# Altium project RPI_POE_ADC_SHIELD.PrjPcb
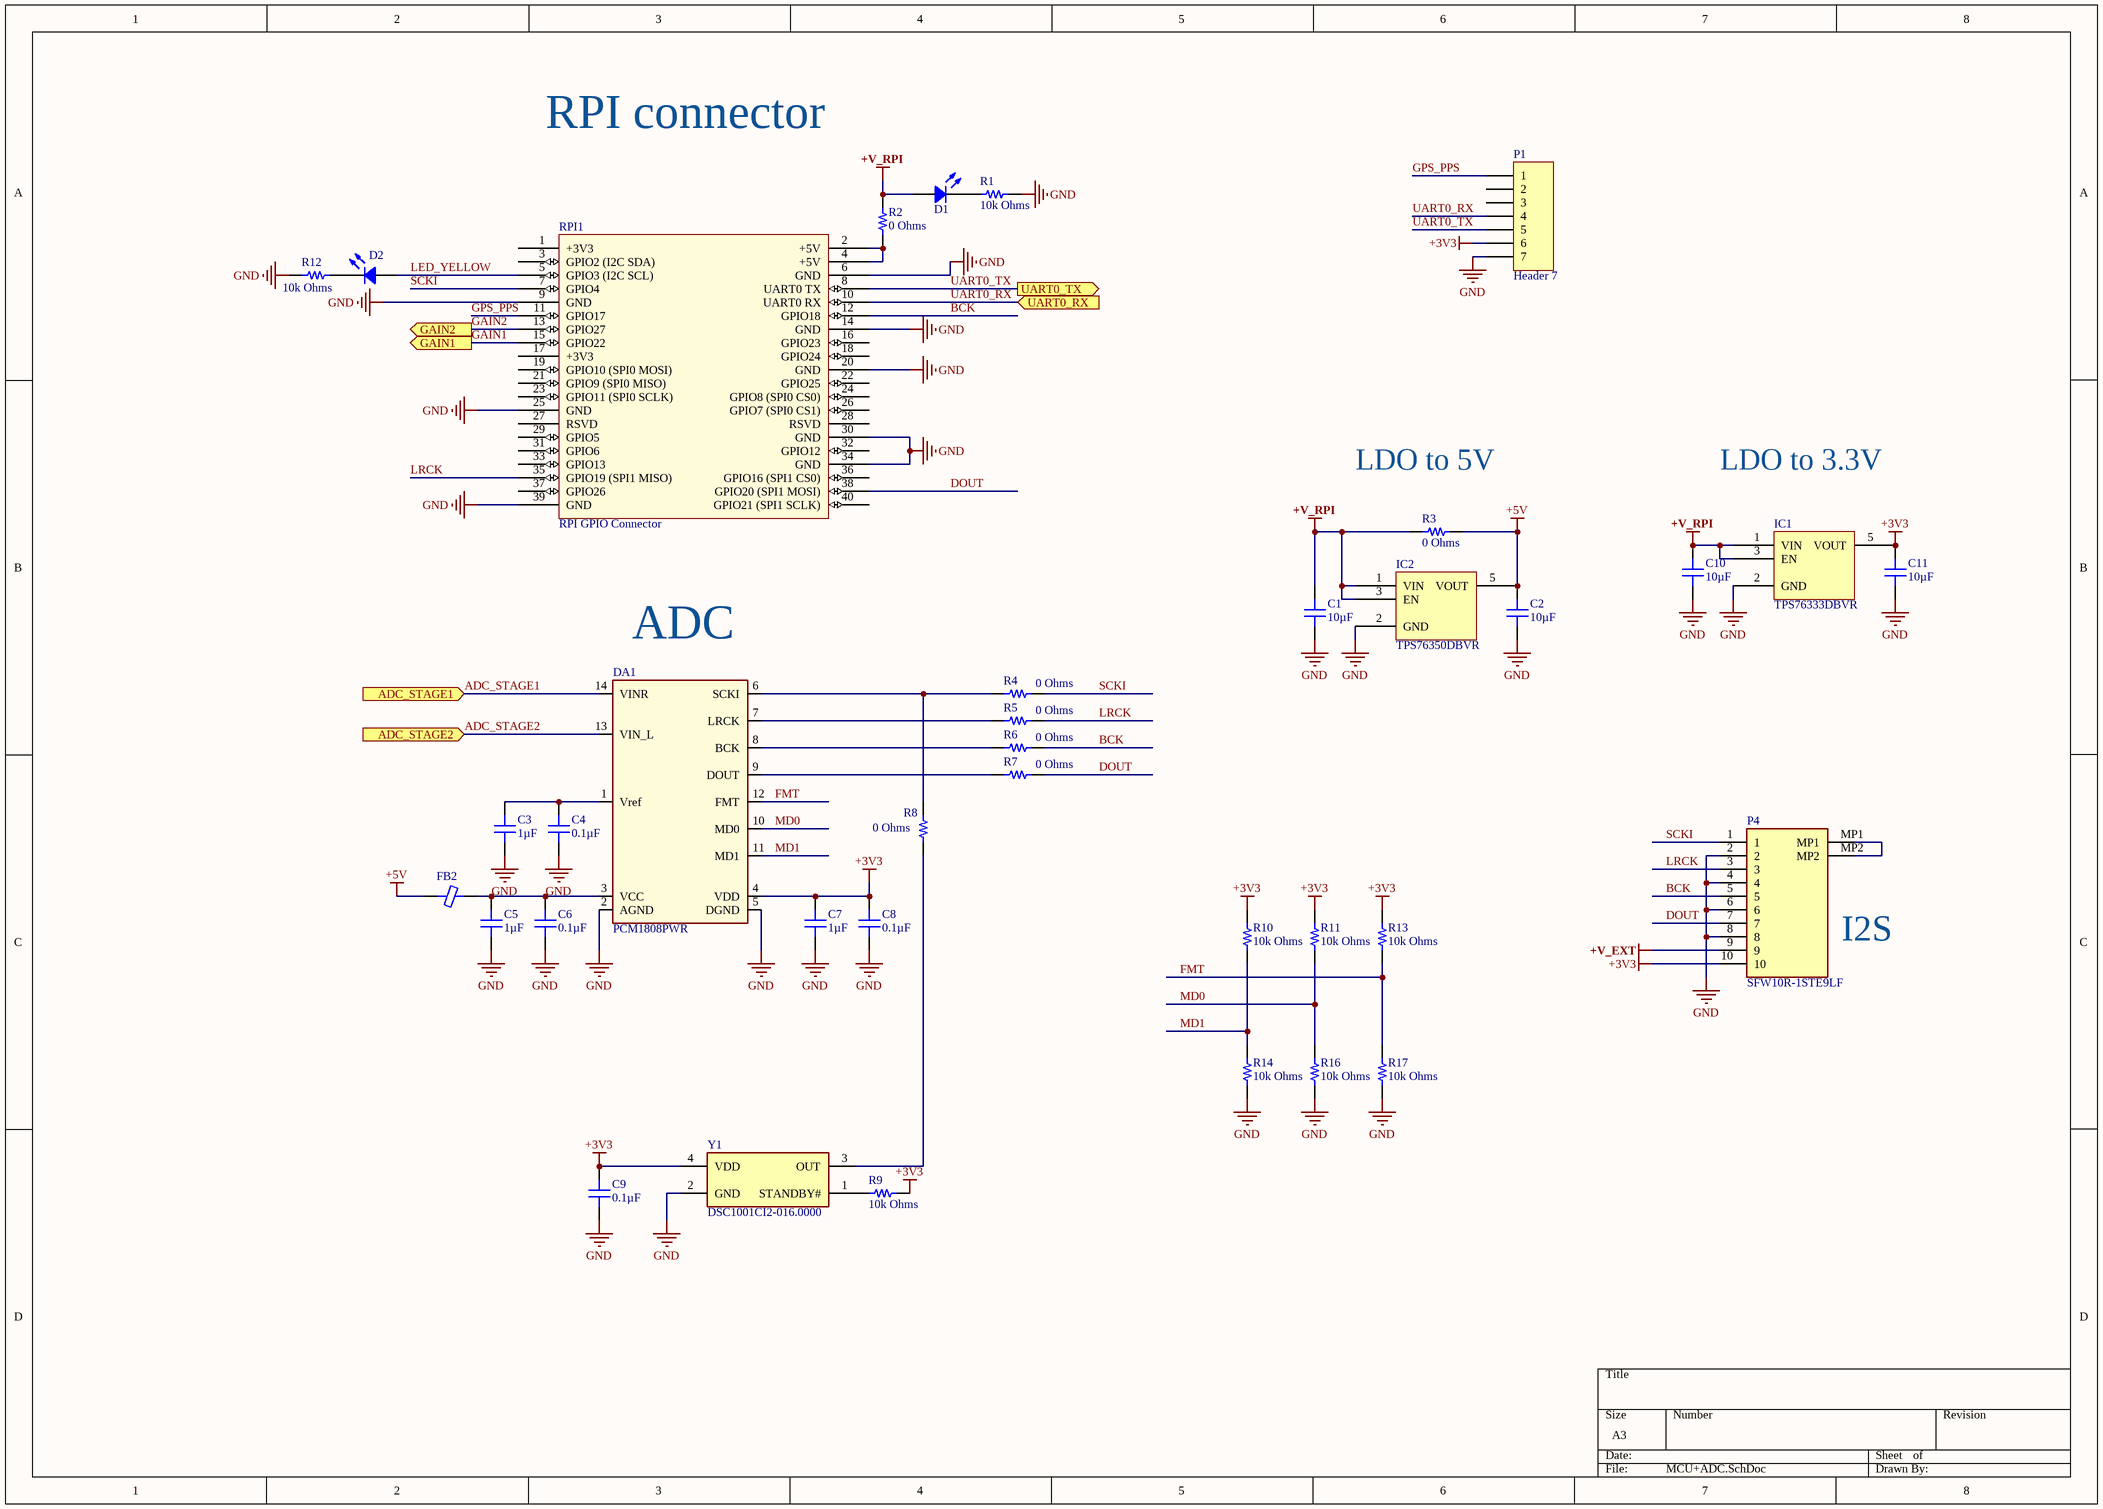
[diagram p0: MCU+ADC.SchDoc]
3 sheets, 118 parts. Net scope: flat (ports and power ports of the same name join across sheets).
Board file: RPI_POE_ADC_SHIELD.PcbDoc
Sheets:
  MCU+ADC.SchDoc
  Analog.SchDoc
  Power+RPI_conn.SchDoc

## Sheet MCU+ADC.SchDoc
size A3

### Parts
C1  10µF  [CAP 0603_1608]
C2  10µF  [CAP 0603_1608]
C3  1µF  [CAP 0603_1608]
C4  0.1µF  [CAP 0603_1608]
C5  1µF  [CAP 0603_1608]
C6  0.1µF  [CAP 0603_1608]
C7  1µF  [CAP 0603_1608]
C8  0.1µF  [CAP 0603_1608]
C9  0.1µF  [CAP 0603_1608]
C10  10µF  [CAP 0603_1608]
C11  10µF  [CAP 0603_1608]
D1  (no value)  [LED 0603_1608 RED]
D2  (no value)  [LED 0603_1608 YELLOW]
DA1  PCM1808PWR  [TSSOP 14]
FB2  (no value)  [FER 0603_1608]
IC1  TPS76333DBVR  [TI SOT-23-5 DBV]
IC2  TPS76350DBVR  [TI SOT-23-5 DBV]
P1  Header 7  [HDR1X7]
P4  SFW10R-1STE9LF  [SFW10R1STE9LF]
R1  10k Ohms  [RES 0603_1608]
R2  0 Ohms  [RES 1206_3216]
R3  0 Ohms  [RES 0603_1608]
R4  0 Ohms  [RES 0603_1608]
R5  0 Ohms  [RES 0603_1608]
R6  0 Ohms  [RES 0603_1608]
R7  0 Ohms  [RES 0603_1608]
R8  0 Ohms  [RES 0603_1608]
R9  10k Ohms  [RES 0603_1608]
R10  10k Ohms  [RES 0603_1608]
R11  10k Ohms  [RES 0603_1608]
R12  10k Ohms  [RES 0603_1608]
R13  10k Ohms  [RES 0603_1608]
R14  10k Ohms  [RES 0603_1608]
R16  10k Ohms  [RES 0603_1608]
R17  10k Ohms  [RES 0603_1608]
RPI1  RPI GPIO Connector  [rpi]
Y1  DSC1001CI2-016.0000  [DSC1001CI20160000]

### Ports
ADC_STAGE1 (in), ADC_STAGE2 (in), GAIN1 (out), GAIN2 (out), UART0_RX (in), UART0_TX (out)

### Nets
+3V3: C7.2 C8.2 C9.2 C11.2 DA1.4(VDD) IC1.5(VOUT) P1.6 P4.10 R9.1 R10.1 R11.1 R13.1 Y1.4(VDD)
+5V: C2.2 FB2.1 IC2.5(VOUT) R3.1
+V_EXT: P4.9
+V_RPI: C1.2 C10.2 D1.1 IC1.1(VIN) IC1.3(EN) IC2.1(VIN) IC2.3(EN) R2.2 R3.2
GND: C1.1 C2.1 C3.1 C4.1 C5.1 C6.1 C7.1 C8.1 C9.1 C10.1 C11.1 DA1.2(AGND) DA1.5(DGND) IC1.2(GND) IC2.2(GND) P1.7 P4.2 P4.4 P4.6 P4.8 R1.1 R12.1 R14.2 R16.2 R17.2 RPI1.6(GND) RPI1.9(GND) RPI1.14(GND) RPI1.20(GND) RPI1.25(GND) RPI1.30(GND) RPI1.34(GND) RPI1.39(GND) Y1.2(GND)
ADC_STAGE1: DA1.14(VINR) ; port ADC_STAGE1
ADC_STAGE2: DA1.13(VIN_L) ; port ADC_STAGE2
BCK: P4.5 R6.1 RPI1.12(GPIO18)
DOUT: P4.7 R7.1 RPI1.38(GPIO20_(SPI1_MOSI))
FMT: DA1.12(FMT) R13.2 R17.1
GAIN1: RPI1.15(GPIO22) ; port GAIN1
GAIN2: RPI1.13(GPIO27) ; port GAIN2
GPS_PPS: P1.1 RPI1.11(GPIO17)
LED_YELLOW: D2.1 RPI1.5(GPIO3_(I2C_SCL))
LRCK: P4.3 R5.1 RPI1.35(GPIO19_(SPI1_MISO))
MD0: DA1.10(MD0) R11.2 R16.1
MD1: DA1.11(MD1) R10.2 R14.1
SCKI: P4.1 R4.1 RPI1.7(GPIO4)
UART0_RX: P1.4 RPI1.10(UART0_RX) ; port UART0_RX
UART0_TX: P1.5 RPI1.8(UART0_TX) ; port UART0_TX
NetC3_2: C3.2 C4.2 DA1.1(Vref)
NetC5_2: C5.2 C6.2 DA1.3(VCC) FB2.2
NetD1_2: D1.2 R1.2
NetD2_2: D2.2 R12.2
NetDA1_6: DA1.6(SCKI) R4.2 R8.1
NetDA1_7: DA1.7(LRCK) R5.2
NetDA1_8: DA1.8(BCK) R6.2
NetDA1_9: DA1.9(DOUT) R7.2
NetP4_MP1: P4.MP1 P4.MP2
NetR2_1: R2.1 RPI1.2(+5V) RPI1.4(+5V)
NetR8_2: R8.2 Y1.3(OUT)
NetR9_2: R9.2 Y1.1(STANDBY#)

Not connected (* = marked no-connect by the designer): P1 2 3; RPI1 1(+3V3) 3(GPIO2_(I2C_SDA)) 16(GPIO23) 17(+3V3) 18(GPIO24) 19(GPIO10_(SPI0_MOSI)) 21(GPIO9_(SPI0_MISO)) 22(GPIO25) 23(GPIO11_(SPI0_SCLK)) 24(GPIO8_(SPI0_CS0)) 26(GPIO7_(SPI0_CS1)) 27(RSVD) 28(RSVD) 29(GPIO5) 31(GPIO6) 32(GPIO12) 33(GPIO13) 36(GPIO16_(SPI1_CS0)) 37(GPIO26) 40(GPIO21_(SPI1_SCLK))

### Notes on the sheet
- RPI connector
- LDO to 5V
- LDO to 3.3V
- (near DA1) ADC
- (near P4) I2S

### Library data of the parts
C1-C11 = 100X14W104MV4T: CAP CER 0.1UF 10V X7R 0603; Part Number: 100X14W104MV4T
  C1 C2 C10 C11: Value: 10µF
  C3 C5 C7: Value: 1µF
  C4 C6 C8 C9: Value: 0.1µF
D1 = 5973005507F: LED RED 0603 SMD; Part Number: 5973005507F
D2 = 5973408507F: LED YELLOW 0603 SMD; Part Number: 5973408507F
DA1 = PCM1808PWR: Audio ADC, 24 bit, 192 kHz; Manufacturer: Texas Instruments; Vcc min: 3.3V; Vcc max: 5V; Комментарий: АЦП, аудио назначения, 24 bit, 192 kHz; ID: PCM1808PWR; Type: ADC, audio; Temperature: -40…+85; Manufacturer P/N: PCM1808PWR; Digikey p/n: 296-26307-1-ND; Корпус: TSSOP 14
FB2 = 2506031217H0: FERRITE BEAD 0603 1LN; Part Number: 2506031217H0
IC1 = TPS76333DBVR: IC REG LINEAR 3.3V 150MA SOT23-5; Part Number: TPS76333DBVR
IC2 = TPS76350DBVR: IC REG LINEAR 5V 150MA SOT23-5; Manufacturer: Texas Instruments; Control Features: Enable; Current - Quiescent (Iq): 100µA; Current - Supply (Max): 140µA; Number of Regulators: 1; Output Configuration: Positive; Output Type: Fixed; Protection Features: Over Current, Over Temperature, Reverse Polarity; PSRR: 60dB (1kHz); Voltage Dropout (Max): 0.3V @ 150mA; Voltage - Input (Max): 10V; Part Number: TPS76350DBVR; ComponentLink1Description: Datasheet; ComponentLink1URL: http://www.ti.com/general/docs/suppproductinfo.tsp?distId=10&gotoUrl=http%3A%2F%2Fwww.ti.com%2Flit%2Fgpn%2Ftps763; ComponentLink2Description: DigiKey Link; ComponentLink2URL: http://digikey.com/product-detail/en/texas-instruments/TPS76350DBVR/296-11023-1-ND/477325; Current - Output: 150mA; LastUpdated: 02.09.2020 1:24:38; Lifecycle Status: Active; Minimum Order: 1; Mounting Type: Surface Mount; Operating Temperature: -40°C ~ 125°C; Package / Case: SC-74A, SOT-753; Packaging: TapeAndReel; Part Status: Active; Price: 0.33; Series: -; Supplier 1: DigiKey; Supplier Part Number 1: 296-11023-1-ND; Supplier Device Package: SOT-23-5; Voltage - Output (Min/Fixed): 5V
P1 = Header 7: Header, 7-Pin; LatestRevisionDate: 17-Jul-2002; LatestRevisionNote: Re-released for DXP Platform.; Publisher: Altium Limited
P4 = SFW10R-1STE9LF: Connector; Manufacturer_Name: Amphenol; Datasheet Link: http://uk.rs-online.com/web/p/products/1708742; Height: 2.7mm; Manufacturer_Part_Number: SFW10R-1STE9LF; Mouser Part Number: 649-SFW10R-1STE9LF; Mouser Price/Stock: https://www.mouser.co.uk/ProductDetail/Amphenol-FCI/SFW10R-1STE9LF/?qs=0%2FIPJkn5eAy46aTtkIWKXg%3D%3D
R1 R3-R14 R16 R17 = RNCS0603BKE100R: RES 100 OHM 0.1% 1/16W 0603; Part Number: RNCS0603BKE100R
  R1 R9-R14 R16 R17: Value: 10k Ohms
  R3-R8: Value: 0 Ohms
R2 = URG3216L-3500-L-T05: 1206 SIZE, 0.25W, 350 OHM, 0.01%; Manufacturer: Susumu; Power (Watts): 0.25W, 1/4W; Resistance: 350 Ohms; Temperature Coefficient: ±2ppm/°C; Part Number: URG3216L-3500-L-T05; ComponentLink1Description: Datasheet; ComponentLink1URL: https://www.susumu.co.jp/common/pdf/n_catalog_partition03_en.pdf; ComponentLink2Description: DigiKey Link; ComponentLink2URL: http://digikey.com/product-detail/en/susumu/URG3216L-3500-L-T05/408-2057-1-ND/9919091; Composition: Thin Film; Device Package: 1206 (3216 Metric); Features: Anti-Sulfur, Automotive AEC-Q200; Height - Seated (Max): 0.022" (0.55mm); LastUpdated: 02/09/2020 01:12:47; Lifecycle Status: Active; Minimum Order: 1; Number of Terminations: 2; Operating Temperature: -55°C ~ 155°C; Package / Case: 1206 (3216 Metric); Packaging: TapeAndReel; PartId: 36368; Part Status: Active; Price: 4.95; Ratings: AEC-Q200; Series: URG; Size / Dimension: 0.126" L x 0.063" W (3.20mm x 1.60mm); Supplier 1: DigiKey; Supplier Part Number 1: 408-2057-1-ND; Supplier Device Package: 1206; Tolerance: ±0.01%; Value: 0 Ohms
RPI1 = rpi connector: GPIO Header for Raspberry Pi A+/B+/Pi 2/Pi 3 - 2x20; Manufacturer: SparkFun Electronics; Manufacturer Part Number: PRT-14017; Nils Minor: author; nilsminor@web.de: mail; RoHS: RoHS Compliant; Category: Development Boards, Kits, Programmers; Stock 1: 150; Pricing 1: 1=1.84 (EUR); Part Status: Active; Accessory Type: Connector; For Use With/Related Products: Raspberry Pi; ComponentLink1URL: https://cdn.sparkfun.com/datasheets/Dev/RaspberryPi/12313.pdf; ComponentLink1Description: https://cdn.sparkfun.com/datasheets/Dev/RaspberryPi/12313.pdf; Supplier 1: Digi-Key; Supplier Part Number 1: 1568-1462-ND
Y1 = DSC1001CI2-016.0000: Crystal or Oscillator; Manufacturer_Name: Microchip; Datasheet Link: https://ww1.microchip.com/downloads/en/DeviceDoc/20005529B.pdf; Height: 0.9mm; Manufacturer_Part_Number: DSC1001CI2-016.0000

## Sheet Analog.SchDoc
size A3
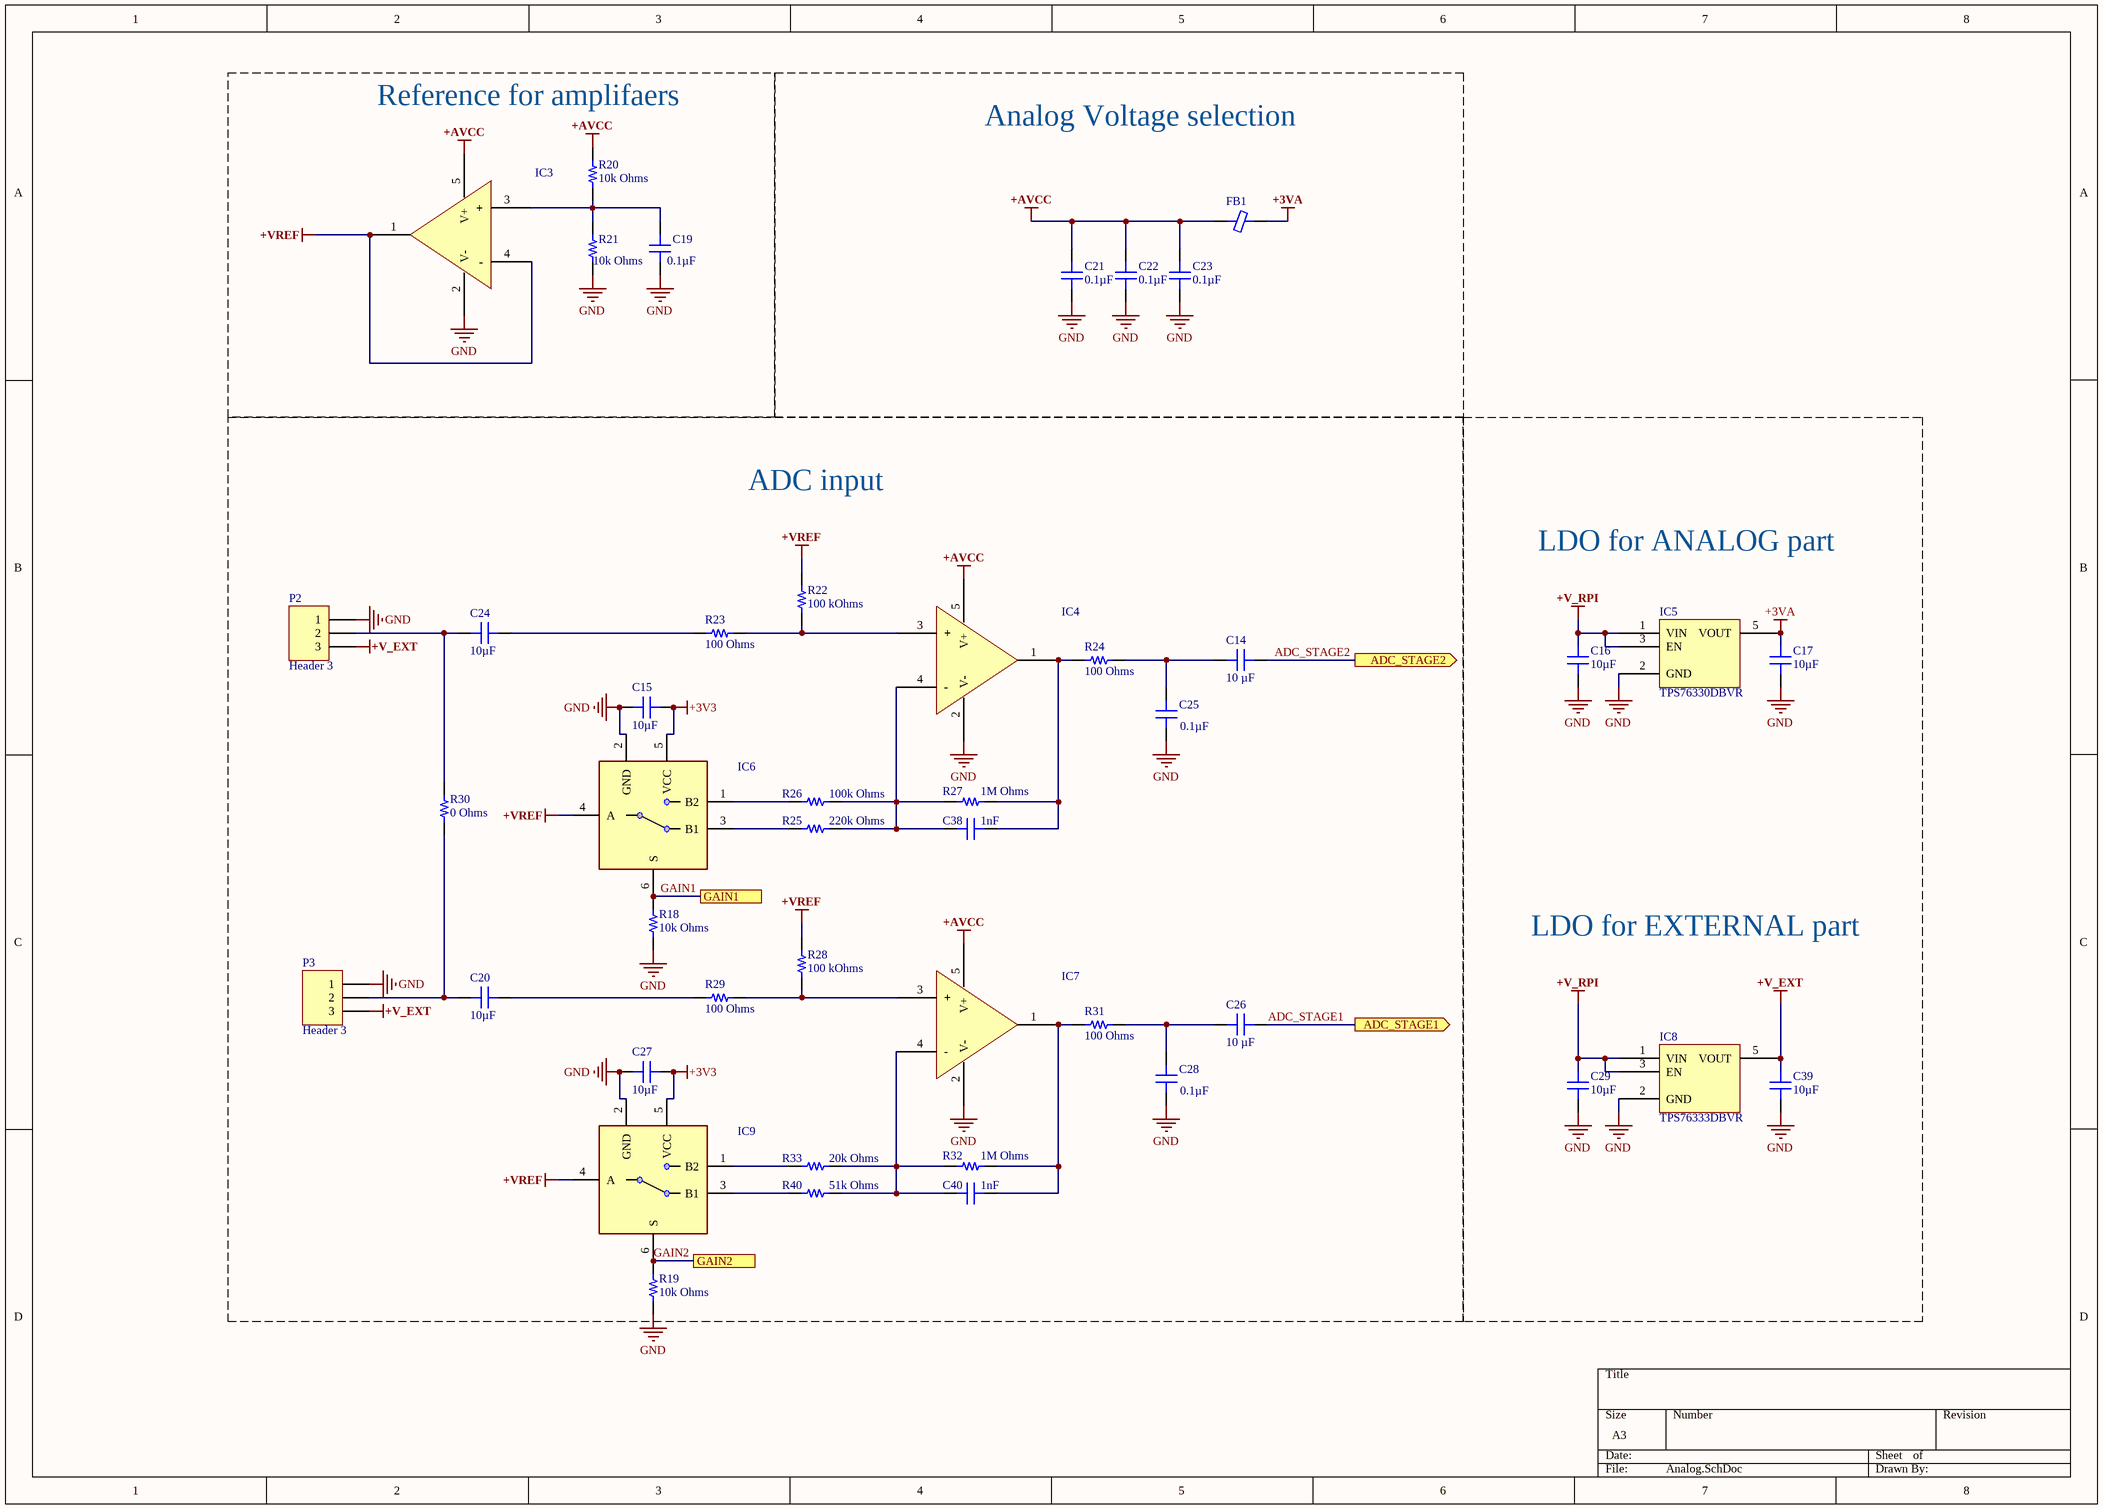
[diagram p1: Analog.SchDoc]

### Parts
C14  10 µF  [CAP 0603_1608]
C15  10µF  [CAP 0603_1608]
C16  10µF  [CAP 0603_1608]
C17  10µF  [CAP 0603_1608]
C19  0.1µF  [CAP 0603_1608]
C20  10µF  [CAP 0603_1608]
C21  0.1µF  [CAP 0603_1608]
C22  0.1µF  [CAP 0603_1608]
C23  0.1µF  [CAP 0603_1608]
C24  10µF  [CAP 0603_1608]
C25  0.1µF  [CAP 0603_1608]
C26  10 µF  [CAP 0603_1608]
C27  10µF  [CAP 0603_1608]
C28  0.1µF  [CAP 0603_1608]
C29  10µF  [CAP 0603_1608]
C38  1nF  [CAP 0603_1608]
C39  10µF  [CAP 0603_1608]
C40  1nF  [CAP 0603_1608]
FB1  (no value)  [FER 0603_1608]
IC3  AD8541ARTZ-REEL7  [ANALOG SOT-23-5 RJ-5]  (value not drawn)
IC4  AD8541ARTZ-REEL7  [ANALOG SOT-23-5 RJ-5]  (value not drawn)
IC5  TPS76330DBVR  [TI SOT-23-5 DBV]
IC6  SN74LVC1G3157DCK3  [SOT65P210X110-6N]  (value not drawn)
IC7  AD8541ARTZ-REEL7  [ANALOG SOT-23-5 RJ-5]  (value not drawn)
IC8  TPS76333DBVR  [TI SOT-23-5 DBV]
IC9  SN74LVC1G3157DCK3  [SOT65P210X110-6N]  (value not drawn)
P2  Header 3  [HDR1X3]
P3  Header 3  [HDR1X3]
R18  10k Ohms  [RES 0603_1608]
R19  10k Ohms  [RES 0603_1608]
R20  10k Ohms  [RES 0603_1608]
R21  10k Ohms  [RES 0603_1608]
R22  100 kOhms  [RES 0603_1608]
R23  100 Ohms  [RES 0603_1608]
R24  100 Ohms  [RES 0603_1608]
R25  220k Ohms  [RES 0603_1608]
R26  100k Ohms  [RES 0603_1608]
R27  1M Ohms  [RES 0603_1608]
R28  100 kOhms  [RES 0603_1608]
R29  100 Ohms  [RES 0603_1608]
R30  0 Ohms  [RES 0603_1608]
R31  100 Ohms  [RES 0603_1608]
R32  1M Ohms  [RES 0603_1608]
R33  20k Ohms  [RES 0603_1608]
R40  51k Ohms  [RES 0603_1608]

### Ports
ADC_STAGE1 (out), ADC_STAGE2 (out), GAIN1, GAIN2

### Nets
+3V3: C15.1 C27.1 IC6.5(VCC) IC9.5(VCC)
+3VA: C17.2 FB1.2 IC5.5(VOUT)
+AVCC: C21.2 C22.2 C23.2 FB1.1 IC3.5(V+) IC4.5(V+) IC7.5(V+) R20.2
+V_EXT: C39.2 IC8.5(VOUT) P2.3 P3.3
+V_RPI: C16.2 C29.2 IC5.1(VIN) IC5.3(EN) IC8.1(VIN) IC8.3(EN)
+VREF: IC3.1(OUT) IC3.4(-) IC6.4(A) IC9.4(A) R22.1 R28.1
GND: C15.2 C16.1 C17.1 C19.1 C21.1 C22.1 C23.1 C25.1 C27.2 C28.1 C29.1 C39.1 IC3.2(V-) IC4.2(V-) IC5.2(GND) IC6.2(GND) IC7.2(V-) IC8.2(GND) IC9.2(GND) P2.1 P3.1 R18.1 R19.1 R21.1
ADC_STAGE1: C26.2 ; port ADC_STAGE1
ADC_STAGE2: C14.2 ; port ADC_STAGE2
GAIN1: IC6.6(S) R18.2 ; port GAIN1
GAIN2: IC9.6(S) R19.2 ; port GAIN2
NetC14_1: C14.1 C25.2 R24.1
NetC19_2: C19.2 IC3.3(+) R20.1 R21.2
NetC20_1: C20.1 R29.2
NetC20_2: C20.2 P3.2 R30.2
NetC24_1: C24.1 R23.2
NetC24_2: C24.2 P2.2 R30.1
NetC26_1: C26.1 C28.2 R31.1
NetC38_1: C38.1 IC4.1(OUT) R24.2 R27.1
NetC38_2: C38.2 IC4.4(-) R25.1 R26.1 R27.2
NetC40_1: C40.1 IC7.1(OUT) R31.2 R32.1
NetC40_2: C40.2 IC7.4(-) R32.2 R33.1 R40.1
NetIC4_3: IC4.3(+) R22.2 R23.1
NetIC6_1: IC6.1(B2) R26.2
NetIC6_3: IC6.3(B1) R25.2
NetIC7_3: IC7.3(+) R28.2 R29.1
NetIC9_1: IC9.1(B2) R33.2
NetIC9_3: IC9.3(B1) R40.2

### Notes on the sheet
- (near R20) Reference for amplifaers
- Analog Voltage selection
- ADC input
- LDO for ANALOG part
- LDO for EXTERNAL part

### Library data of the parts
C14-C17 C19-C29 C38-C40 = 100X14W104MV4T: CAP CER 0.1UF 10V X7R 0603; Part Number: 100X14W104MV4T
  C14 C26: Value: 10 µF
  C15-C17 C20 C24 C27 C29 C39: Value: 10µF
  C19 C21-C23 C25 C28: Value: 0.1µF
  C38 C40: Value: 1nF
FB1 = 2506031217H0: FERRITE BEAD 0603 1LN; Part Number: 2506031217H0
IC3 IC4 IC7 = AD8541ARTZ-REEL7: IC OPAMP GP 1 CIRCUIT SOT23-5; Manufacturer: Analog Devices Inc.; Amplifier Type: General Purpose; Current - Input Bias: 4pA; Current - Output / Channel: 30mA; Current - Supply: 45µA; Gain Bandwidth Product: 1MHz; Number of Circuits: 1; Output Type: Rail-to-Rail; Slew Rate: 0.92V/µs; Voltage - Input Offset: 1mV; Voltage - Supply, Single/Dual (±): 2.7V ~ 5.5V; Part Number: AD8541ARTZ-REEL7; ComponentLink1Description: Datasheet; ComponentLink1URL: https://www.analog.com/media/en/technical-documentation/data-sheets/AD8541_8542_8544.pdf; ComponentLink2Description: DigiKey Link; ComponentLink2URL: http://digikey.com/product-detail/en/analog-devices-inc/AD8541ARTZ-REEL7/AD8541ARTZ-REEL7CT-ND/813416; Device Package: SC-74A, SOT-753; LastUpdated: 08.01.2020 23:39:15; Lifecycle Status: Active; Minimum Order: 1; Mounting Type: Surface Mount; Operating Temperature: -40°C ~ 125°C; Package / Case: SC-74A, SOT-753; Packaging: ReReel; PartId: 9; Part Status: Active; Price: 0.00; Series: -; Supplier 1: DigiKey; Supplier Part Number 1: AD8541ARTZ-REEL7CT-ND; Supplier Device Package: SOT-23-5
IC5 = TPS76330DBVR: IC REG LINEAR 3V 150MA SOT23-5; Manufacturer: Texas Instruments; Control Features: Enable; Current - Quiescent (Iq): 100µA; Current - Supply (Max): 140µA; Number of Regulators: 1; Output Configuration: Positive; Output Type: Fixed; Protection Features: Over Current, Over Temperature, Reverse Polarity; PSRR: 60dB (1kHz); Voltage - Input (Max): 10V; Part Number: TPS76330DBVR; ComponentLink1Description: Datasheet; ComponentLink1URL: http://www.ti.com/general/docs/suppproductinfo.tsp?distId=10&gotoUrl=http%3A%2F%2Fwww.ti.com%2Flit%2Fgpn%2Ftps763; ComponentLink2Description: DigiKey Link; ComponentLink2URL: http://digikey.com/product-detail/en/texas-instruments/TPS76330DBVR/296-11020-1-ND/477336; Current - Output: 150mA; LastUpdated: 02.09.2020 1:24:38; Lifecycle Status: Active; Minimum Order: 1; Mounting Type: Surface Mount; Operating Temperature: -40°C ~ 125°C; Package / Case: SC-74A, SOT-753; Packaging: TapeAndReel; Part Status: Active; Price: 0.33; Series: -; Supplier 1: DigiKey; Supplier Part Number 1: 296-11020-1-ND; Supplier Device Package: SOT-23-5; Voltage - Output (Min/Fixed): 3V
IC6 IC9 = SN74LVC1G3157DCK3: Integrated Circuit; Manufacturer_Name: Texas Instruments; Datasheet Link: http://www.ti.com/general/docs/suppproductinfo.tsp?distId=26&gotoUrl=http%3A%2F%2Fwww.ti.com%2Flit%2Fgpn%2FSN74LVC1G3157; Height: 1.1mm; Manufacturer_Part_Number: SN74LVC1G3157DCK3; Mouser Part Number: 595-74LVC1G3157DCK3; Mouser Price/Stock: https://www.mouser.co.uk/ProductDetail/Texas-Instruments/SN74LVC1G3157DCK3?qs=gHXEOK8GIg%2FmbZPnkwnSeQ%3D%3D; Arrow Part Number: SN74LVC1G3157DCK3; Arrow Price/Stock: https://www.arrow.com/en/products/sn74lvc1g3157dck3/texas-instruments
IC8 = TPS76333DBVR: IC REG LINEAR 3.3V 150MA SOT23-5; Part Number: TPS76333DBVR
P2 P3 = Header 3: Header, 3-Pin; LatestRevisionDate: 17-Jul-2002; LatestRevisionNote: Re-released for DXP Platform.; Publisher: Altium Limited
R18-R33 R40 = RNCS0603BKE100R: RES 100 OHM 0.1% 1/16W 0603; Part Number: RNCS0603BKE100R
  R18-R21: Value: 10k Ohms
  R22 R28: Value: 100 kOhms
  R23 R24 R29 R31: Value: 100 Ohms
  R25: Value: 220k Ohms
  R26: Value: 100k Ohms
  R27 R32: Value: 1M Ohms
  R30: Value: 0 Ohms
  R33: Value: 20k Ohms
  R40: Value: 51k Ohms

## Sheet Power+RPI_conn.SchDoc
size A3
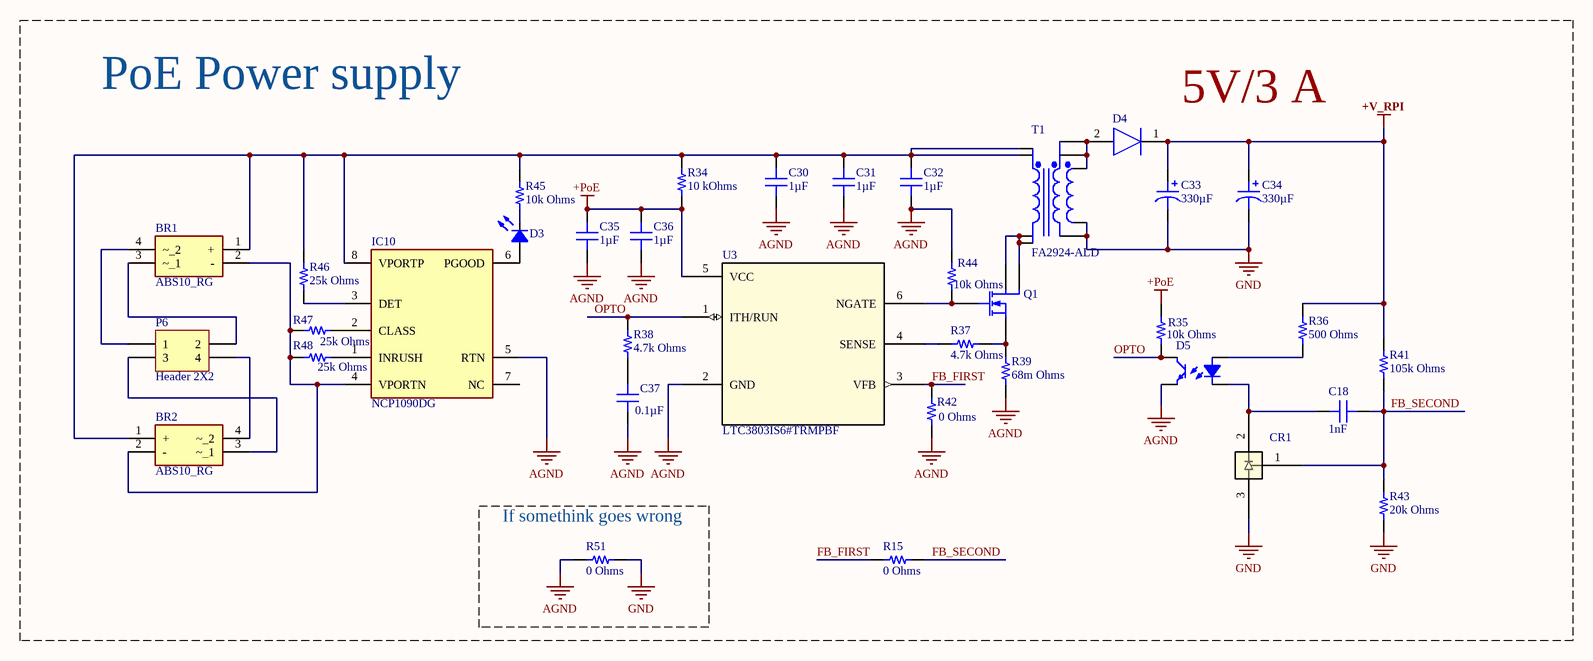
[diagram p2: Power+RPI_conn.SchDoc]

### Parts
BR1  ABS10_RG  [SOP400P645X160-4N]
BR2  ABS10_RG  [SOP400P645X160-4N]
C18  1nF  [CAP 0603_1608]
C30  1µF  [CAP 1206_3216 - 1.8MM]
C31  1µF  [CAP 1206_3216 - 1.8MM]
C32  1µF  [CAP 1206_3216 - 1.8MM]
C33  330µF  [CAP POL 2917_7343]
C34  330µF  [CAP POL 2917_7343]
C35  1µF  [CAP 1206_3216 - 1.8MM]
C36  1µF  [CAP 1206_3216 - 1.8MM]
C37  0.1µF  [CAP 0603_1608]
CR1  TLV431BFTA  [SOT23_DIO]  (value not drawn)
D3  (no value)  [LED 0603_1608 RED]
D4  SK56B_R4  [DIONM5236X261N]  (value not drawn)
D5  LTV-817S-TA1  [LITEON LTV-817]  (value not drawn)
IC10  NCP1090DG  [SOIC127P600X175-8N]
P6  Header 2X2  [HDR2X2]
Q1  IRFL4315TRPBF  [SOT230P700X180-4N]  (value not drawn)
R15  0 Ohms  [RES 2512_6432]
R34  10 kOhms  [RES 1206_3216]
R35  10k Ohms  [RES 0603_1608]
R36  500 Ohms  [RES 0603_1608]
R37  4.7k Ohms  [RES 0603_1608]
R38  4.7k Ohms  [RES 0603_1608]
R39  68m Ohms  [RES 1206_3216]
R41  105k Ohms  [RES 0603_1608]
R42  0 Ohms  [RES 0603_1608]
R43  20k Ohms  [RES 0603_1608]
R44  10k Ohms  [RES 0603_1608]
R45  10k Ohms  [RES 0603_1608]
R46  25k Ohms  [RES 0603_1608]
R47  25k Ohms  [RES 0603_1608]
R48  25k Ohms  [RES 0603_1608]
R51  0 Ohms  [RES 2512_6432]
T1  FA2924-ALD  [FA2924ALD]
U3  LTC3803IS6#TRMPBF  [SOT95P280X100-6N]

### Nets
+PoE: C35.2 C36.2 R34.1 R35.2 U3.5(VCC)
+V_RPI: C33.1 C34.1 D4.1(K) R36.2 R41.1
AGND: C30.1 C31.1 C32.1 C35.1 C36.1 C37.1 D5.3 IC10.5(RTN) R39.1 R42.2 R44.2 R51.1 U3.2(GND)
GND: C33.2 C34.2 CR1.3 R43.2 R51.2 T1.9(Sec-) T1.10(Sec-)
FB_FIRST: R15.1 R42.1 U3.3(VFB)
FB_SECOND: C18.1 CR1.1 R15.2 R41.2 R43.1
OPTO: D5.4 R35.1 R38.1 U3.1(ITH/RUN)
NetBR1_1: BR1.1(+) BR2.1(+) C30.2 C31.2 C32.2 IC10.8(VPORTP) R34.2 R45.1 R46.1 T1.1(Pri+) T1.5(Pri+)
NetBR1_2: BR1.2(-) BR2.2(-) IC10.4(VPORTN) R47.1 R48.1
NetBR1_3: BR1.3(~_1) P6.2
NetBR1_4: BR1.4(~_2) P6.1
NetBR2_3: BR2.3(~_1) P6.3
NetBR2_4: BR2.4(~_2) P6.4
NetC18_2: C18.2 CR1.2 D5.2
NetC37_2: C37.2 R38.2
NetD3_1: D3.1 IC10.6(PGOOD)
NetD3_2: D3.2 R45.2
NetD4_2: D4.2(A) T1.6(Sec+) T1.7(Sec+) T1.8(Sec+)
NetD5_1: D5.1 R36.1
NetIC10_1: IC10.1(INRUSH) R48.2
NetIC10_2: IC10.2(CLASS) R47.2
NetIC10_3: IC10.3(DET) R46.2
NetQ1_1: Q1.1(G) R44.1 U3.6(NGATE)
NetQ1_2: Q1.2(D) Q1.4(D_2) T1.2(Pri-) T1.3(Pri-)
NetQ1_3: Q1.3(S) R37.1 R39.2
NetR37_2: R37.2 U3.4(SENSE)

Not connected (* = marked no-connect by the designer): IC10 7(NC)

### Notes on the sheet
- PoE Power supply
- 5V/3 A
- (near R51) If somethink goes wrong

### Library data of the parts
BR1 BR2 = ABS10_RG: Bridge Rectifier; Manufacturer_Name: Taiwan Semiconductor; Manufacturer_Part_Number: ABS10 RG; Datasheet Link: http://210.6.198.34/ich_flag/www.taiwansemi.com/products/datasheet/ABS2 SERIES_L15.pdf; Height: 1.6mm; Arrow Part Number: ABS10 RG; Arrow Price/Stock: https://www.arrow.com/en/products/abs10rg/taiwan-semiconductor
C18 C37 = 100X14W104MV4T: CAP CER 0.1UF 10V X7R 0603; Part Number: 100X14W104MV4T
  C18: Value: 1nF
  C37: Value: 0.1µF
C30-C32 C35 C36 = C1206C105M1RACTU: CAP CER 1UF 100V X7R 1206; Manufacturer: KEMET; Tolerance: ±20%; Part Number: C1206C105M1RACTU; Value: 1µF; Applications: Bypass, Decoupling; Capacitance: 1µF; ComponentLink1Description: Datasheet; ComponentLink1URL: https://api.kemet.com/component-edge/download/datasheet/C1206C105M1RACTU.pdf; ComponentLink2Description: DigiKey Link; ComponentLink2URL: http://digikey.com/product-detail/en/kemet/C1206C105M1RACTU/399-11684-1-ND/5119827; Device Package: 1206 (3216 Metric); LastUpdated: 02/09/2020 01:05:39; Lifecycle Status: Active; Minimum Order: 1; Mounting Type: Surface Mount, MLCC; Operating Temperature: -55°C ~ 125°C; Package / Case: 1206 (3216 Metric); Packaging: TapeAndReel; PartId: 20380; Part Status: Active; Price: 0.13; Series: SMD Comm X7R; Size / Dimension: 0.126" L x 0.063" W (3.20mm x 1.60mm); Supplier 1: DigiKey; Supplier Part Number 1: 399-11684-1-ND; Temperature Coefficient: X7R; Thickness (Max): 0.071" (1.80mm); Voltage - Rated: 100V
C33 C34 = TPSE337M010R0060: CAP TANT 330UF 20% 10V 2917; Manufacturer: AVX Corporation; Manufacturer Size Code: E; ESR (Equivalent Series Resistance): 60mOhm; Type: Molded; Part Number: TPSE337M010R0060; Value: 330µF; Capacitance: 330µF; ComponentLink1Description: Datasheet; ComponentLink1URL: http://datasheets.avx.com/TPS.pdf; ComponentLink2Description: DigiKey Link; ComponentLink2URL: http://digikey.com/product-detail/en/avx-corporation/TPSE337M010R0060/478-4141-1-ND/1164477; Device Package: 2917 (7343 Metric); Features: General Purpose; Height - Seated (Max): 0.169" (4.30mm); LastUpdated: 02/09/2020 01:16:18; Lifecycle Status: Active; Minimum Order: 1; Mounting Type: Surface Mount; Operating Temperature: -55°C ~ 125°C; Package / Case: 2917 (7343 Metric); Packaging: TapeAndReel; PartId: 1652; Part Status: Active; Price: 0.94; Series: TPS; Size / Dimension: 0.287" L x 0.169" W (7.30mm x 4.30mm); Supplier 1: DigiKey; Supplier Part Number 1: 478-4141-1-ND; Tolerance: ±20%; Voltage - Rated: 10V
CR1 = TLV431BFTA: No Description Available; Vendor: Diodes Inc; Built_By: EMA_Cory; SourceLibrary: Add_to_database_2021-02-04; Type: DEV; Datasheet: https://www.diodes.com/assets/Datasheets/TLV431.pdf; Manufacturer_Part_Number: TLV431BFTA; Copyright: Copyright (C) 2018 Accelerated Designs. All rights reserved; RefDes: RefDes
D3 = 5973005507F: LED RED 0603 SMD; Part Number: 5973005507F
D4 = SK56B_R4: Diode; Manufacturer_Name: Taiwan Semiconductor; Manufacturer_Part_Number: SK56B R4; Datasheet Link: http://uk.rs-online.com/web/p/products/7435961; Height: 2.61mm; Mouser Part Number: 821-SK56BR4; Mouser Price/Stock: https://www.mouser.com/Search/Refine.aspx?Keyword=821-SK56BR4; Arrow Part Number: SK56B R4; Arrow Price/Stock: https://www.arrow.com/en/products/sk56br4/taiwan-semiconductor
D5 = LTV-817S-TA1: OPTOISOLATR 5KV TRANSISTOR 4-SMD; Manufacturer: Lite-On Inc.; Current - DC Forward (If) (Max): 50mA; Current Transfer Ratio (Max): 600% @ 5mA; Current Transfer Ratio (Min): 50% @ 5mA; Input Type: DC; Number of Channels: 1; Rise / Fall Time (Typ): 4µs, 3µs; Vce Saturation (Max): 200mV; Voltage - Forward (Vf) (Typ): 1.2V; Voltage - Isolation: 5000Vrms; Voltage - Output (Max): 35V; Part Number: LTV-817S-TA1; ComponentLink1Description: Datasheet; ComponentLink1URL: http://optoelectronics.liteon.com/upload/download/DS-70-96-0016/LTV-8X7%20series%20201610%20.pdf; ComponentLink2Description: DigiKey Link; ComponentLink2URL: http://digikey.com/product-detail/en/lite-on-inc/LTV-817S-TA1/160-1893-1-ND/3306757; Current - Output / Channel: 50mA; Device Package: 4-SMD, Gull Wing; LastUpdated: 12/01/2020 21:58:48; Lifecycle Status: Active; Minimum Order: 1; Mounting Type: Surface Mount; Operating Temperature: -30°C ~ 110°C; Output Type: Transistor; Package / Case: 4-SMD, Gull Wing; Packaging: TapeAndReel; Part Status: Active; Price: 0.12; Series: -; Supplier 1: DigiKey; Supplier Part Number 1: 160-1893-1-ND; Supplier Device Package: 4-SMD
IC10 = NCP1090DG: Integrated Circuit; Manufacturer_Name: ON Semiconductor; Datasheet Link: http://www.onsemi.com/pub/Collateral/NCP1090-D.PDF; Height: 1.75mm; Manufacturer_Part_Number: NCP1090DG; Mouser Part Number: 863-NCP1090DG; Mouser Price/Stock: https://www.mouser.com/Search/Refine.aspx?Keyword=863-NCP1090DG; Arrow Part Number: NCP1090DG; Arrow Price/Stock: https://www.arrow.com/en/products/ncp1090dg/on-semiconductor
P6 = Header 2X2: Header, 2-Pin, Dual row; LatestRevisionDate: 17-Jul-2002; LatestRevisionNote: Re-released for DXP Platform.; Publisher: Altium Limited
Q1 = IRFL4315TRPBF: MOSFET (N-Channel); Manufacturer_Name: Infineon; Datasheet Link: https://www.infineon.com/dgdl/irfl4315pbf.pdf?fileId=5546d462533600a4015356280dbc1fbe; Height: 1.8mm; Manufacturer_Part_Number: IRFL4315TRPBF; Mouser Part Number: 942-IRFL4315TRPBF; Mouser Price/Stock: https://www.mouser.co.uk/ProductDetail/Infineon-IR/IRFL4315TRPBF/?qs=9%252BKlkBgLFf2fNmu5vkaiHg%3D%3D; Arrow Part Number: IRFL4315TRPBF; Arrow Price/Stock: https://www.arrow.com/en/products/irfl4315trpbf/infineon-technologies-ag
R15 R51 = RMCF2512ZT0R00: RES 0 OHM JUMPER 1W 2512; Manufacturer: Stackpole Electronics Inc; Part Number: RMCF2512ZT0R00; ComponentLink1Description: Datasheet; ComponentLink1URL: https://www.seielect.com/catalog/sei-rmcf_rmcp.pdf; ComponentLink2Description: DigiKey Link; ComponentLink2URL: http://digikey.com/product-detail/en/stackpole-electronics-inc/RMCF2512ZT0R00/RMCF2512ZT0R00CT-ND/1942639; Composition: Thick Film; Device Package: 2512 (6432 Metric); Features: Automotive AEC-Q200; Height - Seated (Max): 0.028" (0.70mm); LastUpdated: 02/09/2020 01:27:06; Lifecycle Status: Active; Minimum Order: 1; Number of Terminations: 2; Operating Temperature: -55°C ~ 155°C; Package / Case: 2512 (6432 Metric); Packaging: TapeAndReel; Part Status: Active; Power (Watts): 1W; Price: 0.03; Ratings: AEC-Q200; Resistance: 0 Ohms; Series: RMCF; Size / Dimension: 0.248" L x 0.126" W (6.30mm x 3.20mm); Supplier 1: DigiKey; Supplier Part Number 1: RMCF2512ZT0R00CT-ND; Supplier Device Package: 2512; Tolerance: Jumper; Value: 0 Ohms
R34 = RT1206BRD0733KL: RES SMD 33K OHM 0.1% 1/4W 1206; Manufacturer: Yageo; Power (Watts): 0.25W, 1/4W; Temperature Coefficient: ±25ppm/°C; Part Number: RT1206BRD0733KL; ComponentLink1Description: Datasheet; ComponentLink1URL: https://www.yageo.com/upload/media/product/productsearch/datasheet/rchip/PYu-RT_1-to-0.01_RoHS_L_11.pdf; ComponentLink2Description: DigiKey Link; ComponentLink2URL: http://digikey.com/product-detail/en/yageo/RT1206BRD0733KL/YAG2038CT-ND/5139486; Composition: Thin Film; Device Package: 1206 (3216 Metric); Height - Seated (Max): 0.026" (0.65mm); LastUpdated: 02/09/2020 01:13:11; Lifecycle Status: Active; Minimum Order: 1; Number of Terminations: 2; Operating Temperature: -55°C ~ 155°C; Package / Case: 1206 (3216 Metric); Packaging: TapeAndReel; PartId: 26862; Part Status: Active; Price: 0.10; Resistance: 10 kOhms; Series: RT; Size / Dimension: 0.122" L x 0.063" W (3.10mm x 1.60mm); Supplier 1: DigiKey; Supplier Part Number 1: YAG2038CT-ND; Supplier Device Package: 1206; Tolerance: ±0.1%; Value: 10 kOhms
R35-R38 R41-R48 = RNCS0603BKE100R: RES 100 OHM 0.1% 1/16W 0603; Part Number: RNCS0603BKE100R
  R35 R44 R45: Value: 10k Ohms
  R36: Value: 500 Ohms
  R37 R38: Value: 4.7k Ohms
  R41: Value: 105k Ohms
  R42: Value: 0 Ohms
  R43: Value: 20k Ohms
  R46-R48: Value: 25k Ohms
R39 = URG3216L-3500-L-T05: 1206 SIZE, 0.25W, 350 OHM, 0.01%; Manufacturer: Susumu; Power (Watts): 0.25W, 1/4W; Resistance: 350 Ohms; Temperature Coefficient: ±2ppm/°C; Value: 40m Ohms; Part Number: URG3216L-3500-L-T05; ComponentLink1Description: Datasheet; ComponentLink1URL: https://www.susumu.co.jp/common/pdf/n_catalog_partition03_en.pdf; ComponentLink2Description: DigiKey Link; ComponentLink2URL: http://digikey.com/product-detail/en/susumu/URG3216L-3500-L-T05/408-2057-1-ND/9919091; Composition: Thin Film; Device Package: 1206 (3216 Metric); Features: Anti-Sulfur, Automotive AEC-Q200; Height - Seated (Max): 0.022" (0.55mm); LastUpdated: 02/09/2020 01:12:47; Lifecycle Status: Active; Minimum Order: 1; Number of Terminations: 2; Operating Temperature: -55°C ~ 155°C; Package / Case: 1206 (3216 Metric); Packaging: TapeAndReel; PartId: 36368; Part Status: Active; Price: 4.95; Ratings: AEC-Q200; Series: URG; Size / Dimension: 0.126" L x 0.063" W (3.20mm x 1.60mm); Supplier 1: DigiKey; Supplier Part Number 1: 408-2057-1-ND; Supplier Device Package: 1206; Tolerance: ±0.01%
T1 = FA2924-ALD: Transformer; Manufacturer_Name: COILCRAFT; Datasheet Link: https://www.coilcraft.com/pdfs/fa2805.pdf; Height: 12.7mm; Manufacturer_Part_Number: FA2924-ALD; Mouser Part Number: 994-FA2924-ALD; Mouser Price/Stock: https://www.mouser.co.uk/ProductDetail/Coilcraft/FA2924-ALD/?qs=ZYnrCdKdyefew%252BIVULR6AA%3D%3D
U3 = LTC3803IS6-5#TRMPBF: No Description Available; Vendor: Linear Technology; Built_By: EMA_UL_Team; SourceLibrary: LinearTech_2016-05-13_6; Manufacturer_Part_Number: LTC3803IS6-5#TRMPBF; Copyright: Copyright (C) 2018 Accelerated Designs. All rights reserved; RefDes: RefDes; Type: DEV

## Nets that join several sheets
+3V3: MCU+ADC (13 pins), Analog (C15.1 C27.1 IC6.5 IC9.5)
+V_EXT: MCU+ADC (P4.9), Analog (C39.2 IC8.5 P2.3 P3.3)
+V_RPI: MCU+ADC (9 pins), Analog (6 pins), Power+RPI_conn (5 pins)
GND: MCU+ADC (34 pins), Analog (24 pins), Power+RPI_conn (7 pins)
ADC_STAGE1: MCU+ADC (DA1.14), Analog (C26.2)
ADC_STAGE2: MCU+ADC (DA1.13), Analog (C14.2)
GAIN1: MCU+ADC (RPI1.15), Analog (IC6.6 R18.2)
GAIN2: MCU+ADC (RPI1.13), Analog (IC9.6 R19.2)